# EAGLE design 2 (EAGLE 6.5.0)
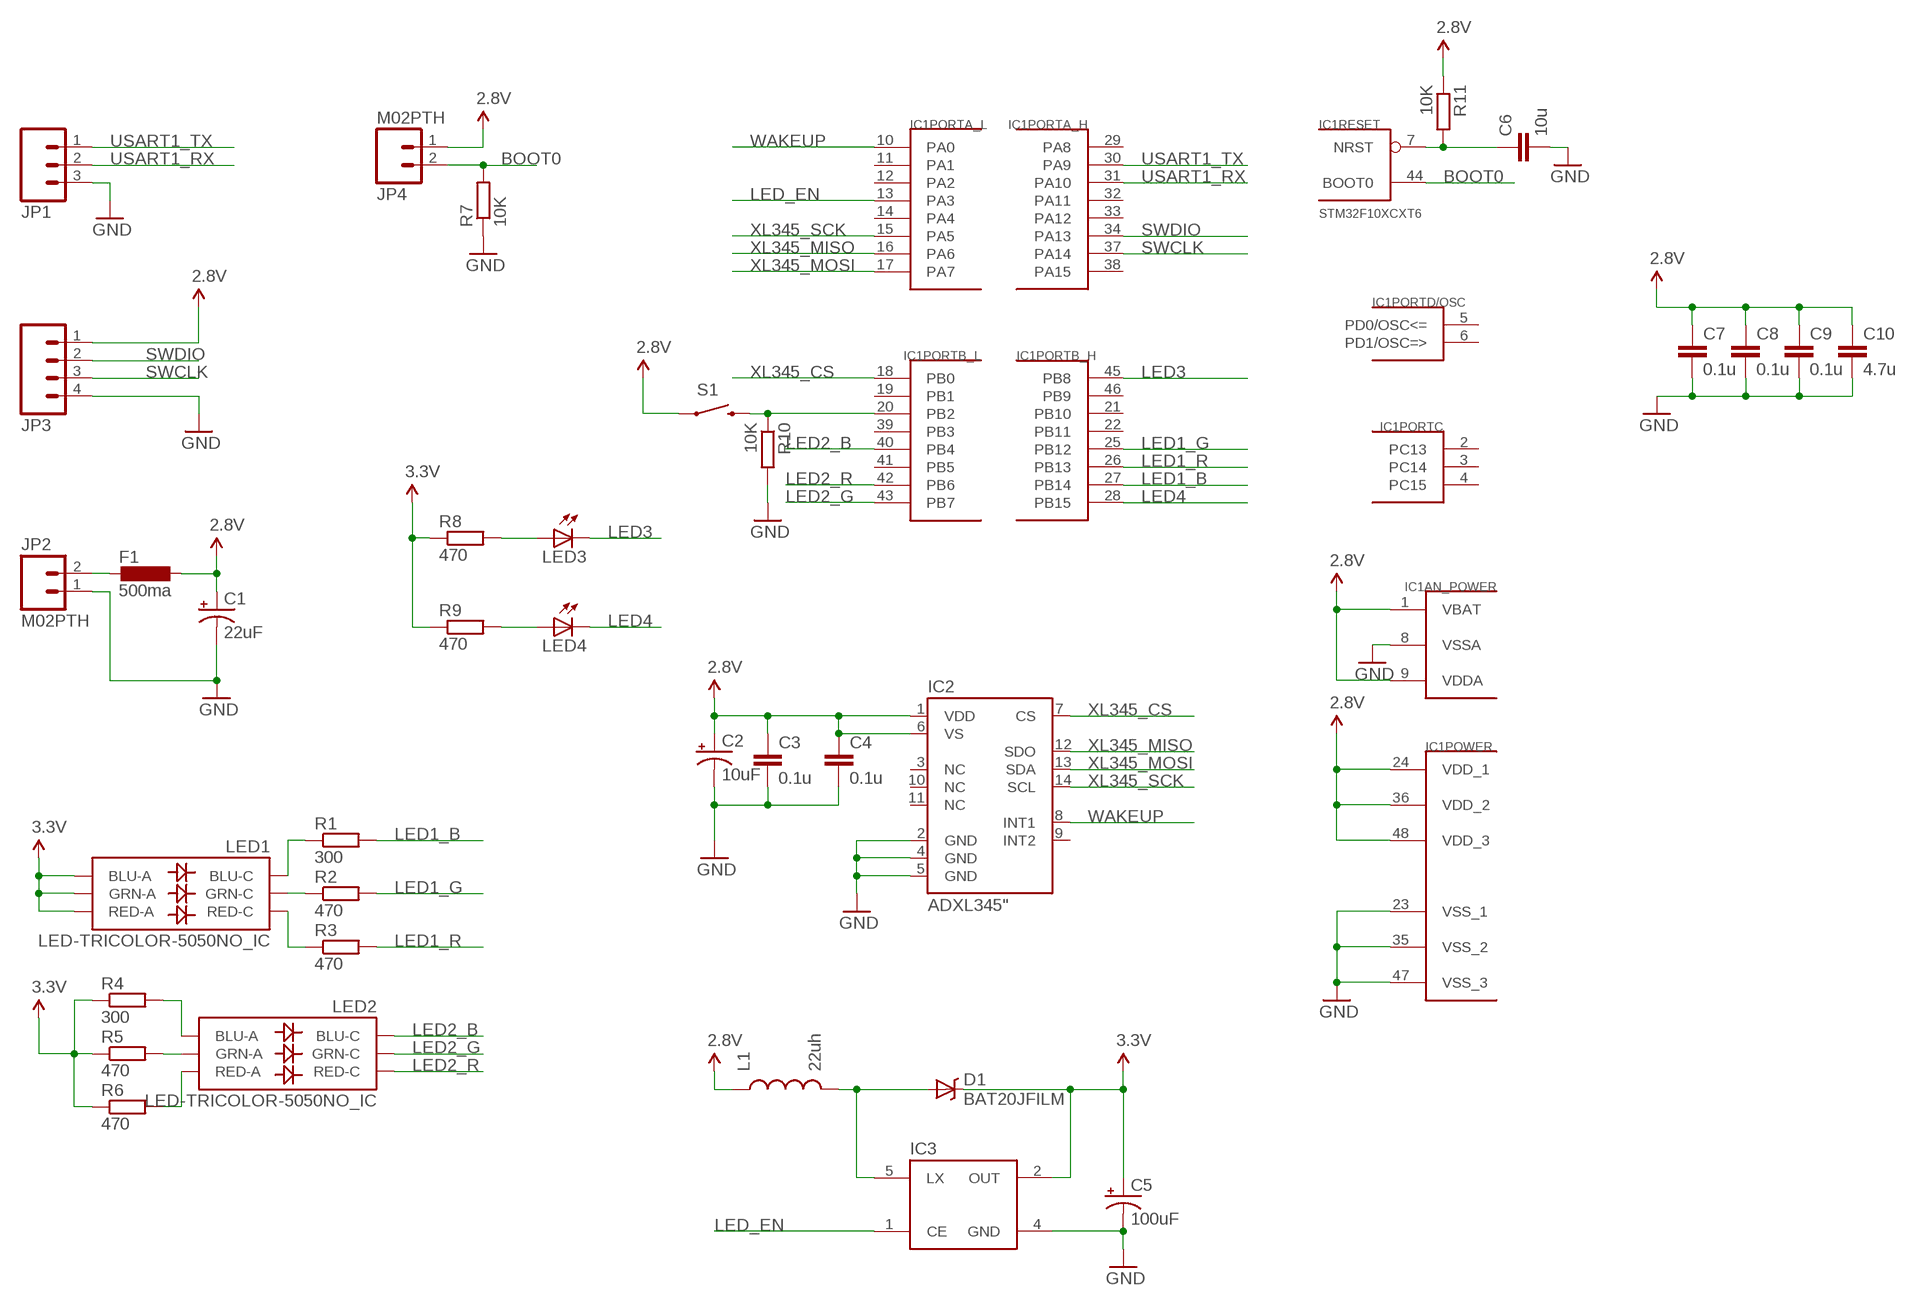
[diagram p0: schematic, sheet 1]

## Parts
C1  22uF  10UF-16V-10%(TANT)  [EIA3216]
C2  10uF  10UF-16V-10%(TANT)  [EIA3216]
C3  0.1u  C-EUC0603K  [C0603K]
C4  0.1u  C-EUC0603K  [C0603K]
C5  100uF  47UF-TANT  [EIA3528]
C6  10u  C-EUC0603K  [C0603K]
C7  0.1u  C-EUC0603K  [C0603K]
C8  0.1u  C-EUC0603K  [C0603K]
C9  0.1u  C-EUC0603K  [C0603K]
C10  4.7u  C-EUC0603K  [C0603K]
D1  BAT20JFILM  [SOD-323]
F1  500ma  L-EUL2012C  [L2012C]
IC1  STM32F10XCXT6  [TQFP48]
IC2  ADXL345"  [ADXL3451:1]
IC3  BL8530-XX2_RN  [SOT23-5]
JP1  M03PTH  [1X03]
JP2  M02PTH  [1X02]
JP3  M04PTH  [1X04]
JP4  M02PTH  [1X02]
L1  22uh  INDUCTORVLF4012A  [VLF4012A]
LED1  LED-TRICOLOR-5050NO_IC  [LED-TRICOLOR-5050]
LED2  LED-TRICOLOR-5050NO_IC  [LED-TRICOLOR-5050]
LED3  LED1206  [LED-1206]
LED4  LED1206  [LED-1206]
R1  300  R-EU_R0603  [R0603]
R2  470  R-EU_R0603  [R0603]
R3  470  R-EU_R0603  [R0603]
R4  300  R-EU_R0603  [R0603]
R5  470  R-EU_R0603  [R0603]
R6  470  R-EU_R0603  [R0603]
R7  10K  R-EU_R0603  [R0603]
R8  470  R-EU_R0603  [R0603]
R9  470  R-EU_R0603  [R0603]
R10  10K  R-EU_R0603  [R0603]
R11  10K  R-EU_R0603  [R0603]
S1  SWITCH-MOMENTARY-2-SMD-1101NE  [TACTILE-SWITCH-1101NE]

## Nets
2.8V: C1.A(+) C2.A(+) C3.1 C4.1 C7.1 C8.1 C9.1 C10.1 F1.1 IC1.1(AN_POWER:VBAT) IC1.9(AN_POWER:VDDA) IC1.24(POWER:VDD_1) IC1.36(POWER:VDD_2) IC1.48(POWER:VDD_3) IC2.1(VDD) IC2.6(VS) JP3.1 JP4.1 L1.P$1 R11.1 S1.P$1
3.3V: C5.A(+) D1.1(C) IC3.2(OUT) LED1.1(GRN-A) LED1.2(RED-A) LED1.3(BLU-A) R4.1 R5.1 R6.1 R8.1 R9.1
BOOT0: IC1.44(RESET:BOOT0) JP4.2 R7.2
GND: C1.C(-) C2.C(-) C3.2 C4.2 C5.C(-) C6.2 C7.2 C8.2 C9.2 C10.2 IC1.8(AN_POWER:VSSA) IC1.23(POWER:VSS_1) IC1.35(POWER:VSS_2) IC1.47(POWER:VSS_3) IC2.2(GND) IC2.4(GND) IC2.5(GND) IC3.4(GND) JP1.3 JP2.1 JP3.4 R7.1 R10.2
LED1_B: IC1.27(PORTB_H:PB14) R1.2
LED1_G: IC1.25(PORTB_H:PB12) R2.2
LED1_R: IC1.26(PORTB_H:PB13) R3.2
LED2_B: IC1.40(PORTB_L:PB4) LED2.4(BLU-C)
LED2_G: IC1.43(PORTB_L:PB7) LED2.6(GRN-C)
LED2_R: IC1.42(PORTB_L:PB6) LED2.5(RED-C)
LED3: IC1.45(PORTB_H:PB8) LED3.C
LED4: IC1.28(PORTB_H:PB15) LED4.C
LED_EN: IC1.13(PORTA_L:PA3) IC3.1(CE)
N$1: F1.2 JP2.2
N$2: IC1.20(PORTB_L:PB2) R10.1 S1.P$2
N$3: LED4.A R9.2
N$4: LED3.A R8.2
N$6: LED2.3(BLU-A) R4.2
N$7: LED1.6(GRN-C) R2.1
N$8: LED2.2(RED-A) R6.2
N$9: LED1.4(BLU-C) R1.1
N$10: LED2.1(GRN-A) R5.2
N$11: LED1.5(RED-C) R3.1
N$12: D1.2(A) IC3.5(LX) L1.P$2
RESET: C6.1 IC1.7(RESET:NRST) R11.2
SWCLK: IC1.37(PORTA_H:PA14) JP3.3
SWDIO: IC1.34(PORTA_H:PA13) JP3.2
USART1_RX: IC1.31(PORTA_H:PA10) JP1.2
USART1_TX: IC1.30(PORTA_H:PA9) JP1.1
WAKEUP: IC1.10(PORTA_L:PA0) IC2.8(INT1)
XL345_CS: IC1.18(PORTB_L:PB0) IC2.7(CS)
XL345_MISO: IC1.16(PORTA_L:PA6) IC2.12(SDO)
XL345_MOSI: IC1.17(PORTA_L:PA7) IC2.13(SDA)
XL345_SCK: IC1.15(PORTA_L:PA5) IC2.14(SCL)
Unconnected: IC1.2(PORTC:PC13) IC1.3(PORTC:PC14) IC1.4(PORTC:PC15) IC1.5(PORTD/OSC:PD0/OSC<=) IC1.6(PORTD/OSC:PD1/OSC=>) IC1.11(PORTA_L:PA1) IC1.12(PORTA_L:PA2) IC1.14(PORTA_L:PA4) IC1.19(PORTB_L:PB1) IC1.21(PORTB_H:PB10) IC1.22(PORTB_H:PB11) IC1.29(PORTA_H:PA8) IC1.32(PORTA_H:PA11) IC1.33(PORTA_H:PA12) IC1.38(PORTA_H:PA15) IC1.39(PORTB_L:PB3) IC1.41(PORTB_L:PB5) IC1.46(PORTB_H:PB9) IC2.3(NC) IC2.9(INT2) IC2.10(NC) IC2.11(NC)

## Library data of the parts
C1 = SparkFun-Capacitors:10UF-16V-10%(TANT): CAP-00811 1206/EIA-3216 Tantalum capacitor; PROD_ID: CAP-00811; VALUE: 10uF
C2 = SparkFun-Capacitors:10UF-16V-10%(TANT): CAP-00811 1206/EIA-3216 Tantalum capacitor; PROD_ID: CAP-00811
C3 C4 C6-C10 = rcl:C-EU: CAPACITOR, European symbol
C5 = SparkFun-Capacitors:47UF-TANT: 47uF Tantalum SMT CAP-08310- 10V 10% (EIA-3528); PROD_ID: CAP-08310; VALUE: 47uF
D1 = SparkFun-DiscreteSemi:BAT20JFILM: 23V, 1A Schottky diode, SOD-323 package; PROD_ID: DIO-11623
F1 = rcl:L-EU: INDUCTOR, European symbol
IC1 = stm32:STM32F10XCXT6: ST STM32F101/103 48pin LQFP
IC2 = SparkFun-Sensors:ADXL345: 3-axis SPI/I2C 2/4/8/16g accelerometer
IC3 = digital-toy:BL8530-XX2_RN: PFC step-up DC boost for BL8530, rn and some other 5 pin boost. by lishen, 2014.3.19
JP1 = SparkFun-Connectors:M03: Header 3 Standard 3-pin 0.1" header. Use with straight break away headers (SKU : PRT-00116), right angle break away headers (PRT-00553), swiss pins (PRT-00743), machine pins (PRT-00117), and female headers (PRT-00115). Molex polarized connector foot print use with SKU : PRT-08232 with associated crimp pins and housings.
JP2 JP4 = SparkFun-Connectors:M02: Standard 2-pin 0.1" header. Use with - straight break away headers ( PRT-00116) - right angle break away headers (PRT-00553) - swiss pins (PRT-00743) - machine pins (PRT-00117) - female headers (PRT-00115) Molex polarized connector foot print use with: PRT-08233 with associated crimp pins and housings. 2.54_SCREWTERM for use with PRT-10571. 3.5mm Screw Terminal footprints for PRT-08084 5mm Screw Terminal footprints for use with PRT-08433
JP3 = SparkFun-Connectors:M04: Header 4 Standard 4-pin 0.1" header. Use with straight break away headers (SKU : PRT-00116), right angle break away headers (PRT-00553), swiss pins (PRT-00743), machine pins (PRT-00117), and female headers (PRT-00115). Molex polarized connector foot print use with SKU : PRT-08231 with associated crimp pins and housings. 1MM SMD Version SKU: PRT-10208
L1 = SparkFun-Passives:INDUCTOR: Inductors Basic Inductor/Choke - 0603 and 1206. Footprints are not proven and vary greatly between part numbers. SRN6045- 33uH, 20% 1.4A SDR0403-560KL - 56uH, 10%, 500mA RMS/740mA peak
LED1 LED2 = SparkFun-LED:LED-TRICOLOR-5050
LED3 LED4 = SparkFun-LED:LED: LEDs Standard schematic elements and footprints for 5mm, 3mm, 1206, and 0603 sized LEDs. 5mm - Spark Fun Electronics SKU : COM-00529 (and others)
R1-R11 = rcl:R-EU_: RESISTOR, European symbol
S1 = SparkFun-Electromechanical:SWITCH-MOMENTARY-2: Various NO switches- pushbuttons, reed, etc

## Board
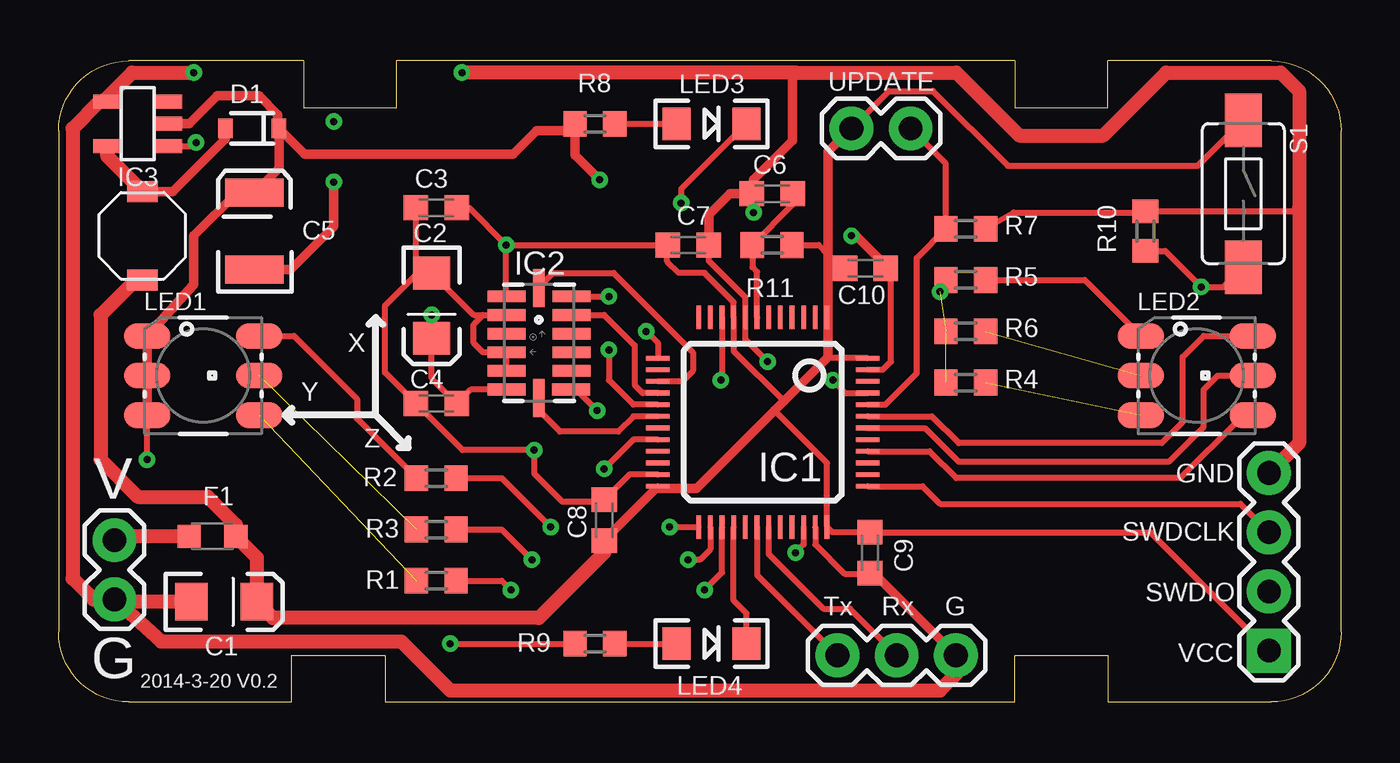
[diagram p1: board, top side]
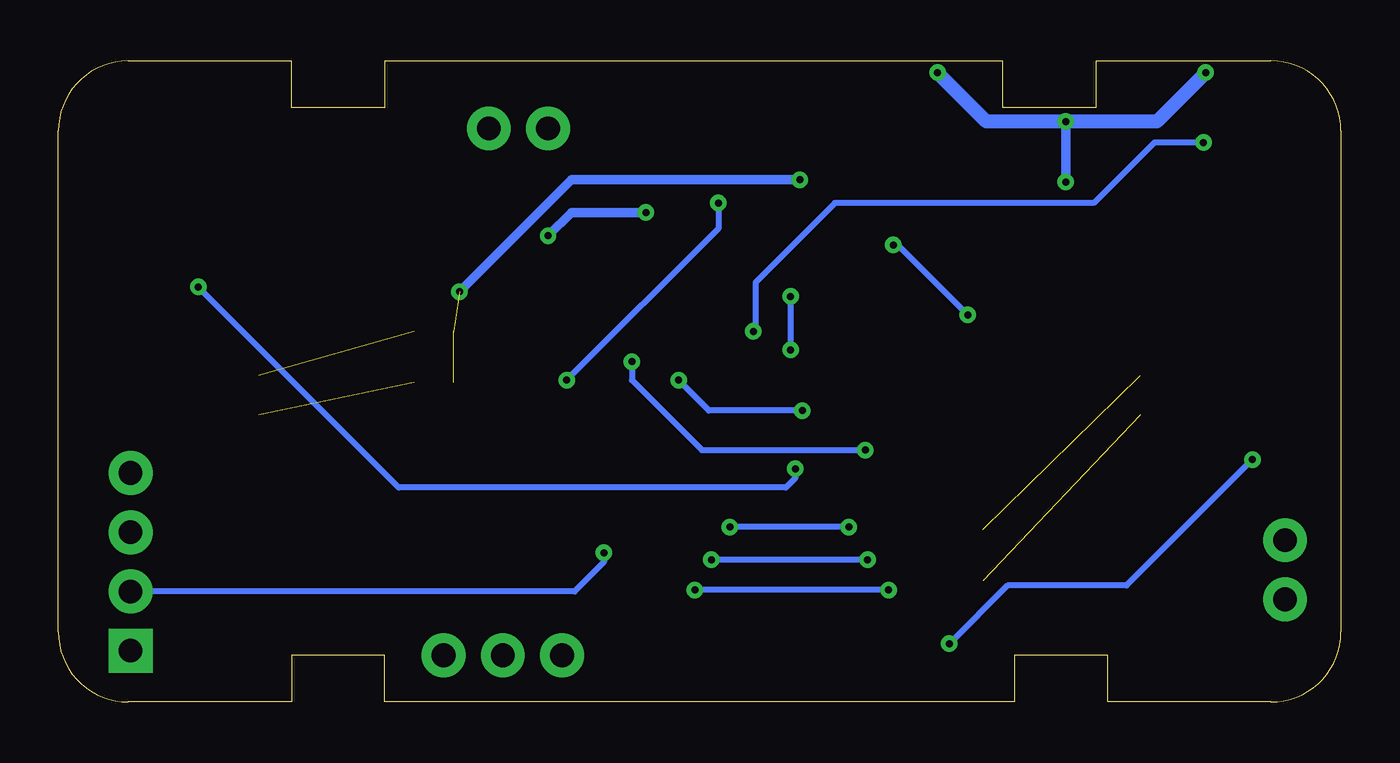
[diagram p2: board, bottom side, seen from below]

Size 55 x 27.5 mm. Coordinates in mm from the lower left corner, seen from the top.
Outline: 3,0 10,0 10,2 14,2 14,0 41,0 41,2 45,2 45,0 52,0 arc90 55,3 55,24.5 arc90 52,27.5 45,27.5 45,25.5 41,25.5 41,27.5 14.5,27.5 14.5,25.5 10.5,25.5 10.5,27.5 3,27.5 arc90 0,24.5 0,3 arc90 3,0
Copper layers (1*16): Top 0.035mm / dielectric 1.5mm / Bottom 0.035mm
Design rules "default *": minimum track width 10mil, minimum drill 24mil, track to track 8mil, track to pad 8mil, pad to pad 8mil, via to via 8mil, smd to smd 8mil, copper to edge 0.1mm, drill to drill 8mil, minimum pad ring 10mil, minimum via ring 8mil, stop-mask expansion 4mil, vias tented up to drill 0mil, thermal gap 10mil

### Footprints (pad centres in the part's own frame; a part is rotated, then mirrored left to right if it is on the bottom)
EIA3216 = smd 1.4 x 1.6: A 1.4,0; C -1.4,0
C0603K = smd 1.05 x 1.08: 1 -0.875,0; 2 0.875,0
EIA3528 = smd 1.2 x 2.5: A 1.65,0; C -1.65,0
SOD-323 = smd 0.63 x 0.83: 1 -1.15,0; 2 1.15,0
L2012C = smd 1 x 1: 1 -1,0; 2 1,0
TQFP48 = smd 0.2 x 1: 1 -2.75,-4.5; 2 -2.25,-4.5; 3 -1.75,-4.5; 4 -1.25,-4.5; 5 -0.75,-4.5; 6 -0.25,-4.5; 7 0.25,-4.5; 8 0.75,-4.5; 9 1.25,-4.5; 10 1.75,-4.5; 11 2.25,-4.5; 12 2.75,-4.5; 25 2.75,4.5; 26 2.25,4.5; 27 1.75,4.5; 28 1.25,4.5; 29 0.75,4.5; 30 0.25,4.5; 31 -0.25,4.5; 32 -0.75,4.5; 33 -1.25,4.5; 34 -1.75,4.5; 35 -2.25,4.5; 36 -2.75,4.5 | smd 1 x 0.2: 13 4.5,-2.75; 14 4.5,-2.25; 15 4.5,-1.75; 16 4.5,-1.25; 17 4.5,-0.75; 18 4.5,-0.25; 19 4.5,0.25; 20 4.5,0.75; 21 4.5,1.25; 22 4.5,1.75; 23 4.5,2.25; 24 4.5,2.75; 37 -4.5,2.75; 38 -4.5,2.25; 39 -4.5,1.75; 40 -4.5,1.25; 41 -4.5,0.75; 42 -4.5,0.25; 43 -4.5,-0.25; 44 -4.5,-0.75; 45 -4.5,-1.25; 46 -4.5,-1.75; 47 -4.5,-2.25; 48 -4.5,-2.75
ADXL3451:1 = smd 0.5 x 1.632: 1 2,1.392; 2 1.2,1.392; 3 0.4,1.392; 4 -0.4,1.392; 5 -1.2,1.392; 6 -2,1.392; 8 -2,-1.384; 9 -1.2,-1.392; 10 -0.4,-1.392; 11 0.4,-1.392; 12 1.2,-1.392; 13 2,-1.392 | smd 1.632 x 0.5: 7 -2.354,0; 14 2.354,0
SOT23-5 = smd 0.6 x 1.2: 1 -0.95,-1.306; 2 0,-1.306; 3 0.95,-1.306; 4 0.95,1.306; 5 -0.95,1.306
1X03 = drill 1.016 pad 1.88: 1 0,0; 2 2.54,0; 3 5.08,0
1X02 = drill 1.016 pad 1.88: 1 0,0; 2 2.54,0
1X04 = drill 1.016 pad 1.88 square: 1 0,0 | drill 1.016 pad 1.88: 2 2.54,0; 3 5.08,0; 4 7.62,0
VLF4012A = smd 0.9 x 1.3: P$1 -1.9,0; P$2 1.9,0
LED-TRICOLOR-5050 = smd 2 x 1.1: 1 -2.4,1.7; 2 -2.4,0; 3 -2.4,-1.7; 4 2.4,-1.7; 5 2.4,0; 6 2.4,1.7
LED-1206 = smd 1.2 x 1.4: A -1.5,0; C 1.5,0
R0603 = smd 1 x 1.1: 1 -0.85,0; 2 0.85,0
TACTILE-SWITCH-1101NE = smd 2.3 x 1.6: P$1 -3.15,0; P$2 3.15,0

### Placement (x,y rotation side)
C1  7.1,4.3 0 top
C2  16,17 270 top
C3  16.2,21.2 180 top
C4  16.2,12.8 180 top
C5  8.4,20.2 90 top
C6  30.6,21.8 180 top
C7  27,19.6 0 top
C8  23.4,7.8 90 top
C9  34.79,6.4 270 top
C10  34.6,18.6 0 top
D1  8.3,24.6 180 top
F1  6.6,7.1 180 top
IC1  30.2,12 180 top
IC2  20.6,15.4 90 top
IC3  3.4,24.8 90 top
JP1  33.4,2 0 top
JP2  2.4,4.4 90 top
JP3  51.9,2.2 90 top
JP4  34,24.6 0 top
L1  3.6,20 90 top
LED1  6.2,14 0 top
LED2  48.8,14 0 top
LED3  28,24.8 0 top
LED4  28,2.5 0 top
R1  16.2,5.2 0 top
R2  16.2,9.6 0 top
R3  16.2,7.4 0 top
R4  38.9,13.7 0 top
R5  38.9,18.1 0 top
R6  38.9,15.9 0 top
R7  38.9,20.3 180 top
R8  23,24.8 0 top
R9  23,2.5 0 top
R10  46.6,20.2 90 top
R11  30.6,19.6 180 top
S1  50.8,21.8 270 top

### Tracks (layer width: path | path; a pad name or v marks a point on that pad's centre or on a via)
2.8V  (via drill 0.3)
  Top 0.254: IC2.6 17.68,13.4 C4.1 16,13.88 C2.A v16,16.6 | IC1.48 33.05,14.75 33,14.8 33,16.45 IC1.1 | 31.1,12.9 28.95,15.05 IC1.9 28.95,17.15 27.7,18.4 26.6,18.4 26.1,18.9 26.1,19.57 C7.1 v19.2,19.6 | 30.7,12.5 32.95,10.25 IC1.36 33.17,7.28 C9.1 46.83,7.28 JP3.1 | JP4.1 35.6,26.2 37.5,26.2 40.7,23 48.85,23 S1.P$1 | R11.1 32.6,19.6 33,19.2 | v19.2,19.6 17.6,21.2 C3.1 | IC2.1 v19.2,19.6 | C10.1 33,18.6 | IC1.24 25.7,9.15
  Top 0.406: JP4.1 33,23.6 33,19.2 33,18.6 33,14.8 31.1,12.9 30.7,12.5 27.35,9.15 25.7,9.15 25.62,9.15 C8.1 23.4,6.4
  Top 0.61: L1.P$1 3.3,18.1 1.8,16.6 1.8,10.4 3.4,8.8 6.4,8.8 7.6,7.6 F1.1 8.5,6.2 C1.A 9.2,3.6 20.6,3.6 23.4,6.4
  Bottom 0.254: v16,16.6 19,19.6 v19.2,19.6
3.3V  (via drill 0.3)  (2 unrouted)
  Top 0.254: v3.8,10.4 LED1.3 | v37.8,17.6 38.3,18.1 R5.1 | v16.8,2.5 R9.1
  Top 0.406: LED1.3 LED1.2 LED1.1 5.8,17.9 5.8,20 7.65,21.85 C5.A 9.45,22.9 D1.1 | IC3.2 5.6,24.8 6.8,26 8.6,26 9.4,25.2 9.4,24.65 D1.1 | 21.95,24.6 R8.1 | R8.1 22.15,23.45 v23.2,22.4 | R8.1 21.85,24.5 20.5,24.5 19.5,23.5 10.55,23.5 D1.1
  Bottom 0.254: v3.8,10.4 9.2,5 14.3,5 v16.8,2.5
  Bottom 0.406: v23.2,22.4 33,22.4 v37.8,17.6
BOOT0
  Top 0.254: IC1.44 35.45,12.75 36.8,14.1 36.8,19.05 R7.2 38.05,23.09 JP4.2
GND  (via drill 0.3)
  Top 0.254: IC2.5 IC2.4 18.2,15 17.8,15.4 17.8,16.2 18.2,16.6 | 18.2,16.6 IC2.2 | C2.C 15.32,19.07 C3.2 | C2.C 17.8,16.6 18.2,16.6 | C2.C 15.4,18.4 14,17 14,14.12 C4.2 17.32,10.8 v20.4,10.8 20.4,9.8 21.6,8.6 23.32,8.6 C8.2 24.48,9.75 IC1.23 | C7.2 27.88,18.93 29.45,17.35 IC1.8 29.45,15.55 v30.4,14.6 | 53.2,21.2 53.05,21.05 R10.2 46.55,21 40.95,21 R7.1 | 35.7,18.38 35.7,14.6 35.35,14.25 IC1.47 | 35.7,18.38 C10.2 | IC1.35 32.45,6.75 33.7,5.5 34.77,5.5 C9.2 | 35.7,18.38 35.7,18.5 35.5,18.7
  Top 0.406: JP1.3 34.95,5.53 C9.2 | 2,25.84 IC3.4 | C6.2 29.8,21.88 29.8,22.4 31.48,24.07 31.48,26.88 31.6,27 | C6.2 28.8,21.8 27.9,20.9 27.9,19.62 C7.2 | 35.5,18.7 34.2,20 v34,20 | v29.8,21 29.73,21.07 C6.2 | C5.C 9.95,18.55 11.8,20.4 v11.8,22.3
  Top 0.61: IC3.4 1.75,25.75 0.6,24.6 0.6,5.3 1.5,4.4 JP2.1 | 2,25.84 3.16,27 v5.8,27 | JP3.4 53.2,11.12 53.2,21.2 53.2,26.2 52.4,27 47.5,27 44.8,24.3 41.2,24.3 38.5,27 31.6,27 v17.3,27 | C1.C 2.5,4.3 JP2.1 | JP2.1 4.4,2.6 14.7,2.6 16.8,0.5 37.8,0.5 38.5,1.2 38.5,1.98 JP1.3
  Bottom 0.254: v30.4,14.6 30.4,13.8 27.4,10.8 v20.4,10.8
  Bottom 0.406: v34,20 33,21 v29.8,21 | v11.8,22.3 v11.8,24.9
  Bottom 0.61: v5.8,27 7.9,24.9 v11.8,24.9 15.2,24.9 v17.3,27
LED1_B  (via drill 0.3)
  Top 0.254: R1.2 19,5.2 v19.4,4.8 | v27.7,4.8 28.45,5.55 IC1.27
  Bottom 0.254: v19.4,4.8 v27.7,4.8
LED1_G  (via drill 0.3)
  Top 0.254: R2.2 19,9.6 v21.1,7.5 | v26.2,7.5 IC1.25
  Bottom 0.254: v21.1,7.5 v26.2,7.5
LED1_R  (via drill 0.3)
  Top 0.254: R3.2 19,7.4 v20.3,6.1 | 27.2,6.1 v27,6.1 27.5,6.1 27.95,6.55 IC1.26
  Bottom 0.254: v20.3,6.1 v27,6.1
LED2_B
  Top 0.254: LED2.4 50.6,12.3 50.6,12.1 48.1,9.6 38.5,9.6 37.35,10.75 IC1.40
LED2_G
  Top 0.254: IC1.43 37.45,12.25 38.6,11.1 47.3,11.1 48.2,12 48.2,14.8 49.1,15.7 LED2.6
LED2_R
  Top 0.254: IC1.42 37.15,11.75 38.6,10.3 47.6,10.3 49.1,11.8 49.1,13.4 49.7,14 LED2.5
LED3  (via drill 0.3)
  Top 0.254: LED3.C 26.7,22 v26.7,21.4 | v33.2,13.8 33.75,13.25 IC1.45
  Bottom 0.254: v26.7,21.4 26.7,20.3 v33.2,13.8
LED4
  Top 0.254: LED4.C 29.5,3.8 28.95,4.35 IC1.28
LED_EN  (via drill 0.3)
  Top 0.254: IC3.1 5.75,23.85 v5.9,24 | v25.2,15.9 25.7,15.4 IC1.13
  Bottom 0.254: v5.9,24 8,24 10.6,21.4 21.7,21.4 25.1,18 25.1,16 v25.2,15.9
N$1
  Top 0.61: F1.2 2.56,7.1 JP2.2
N$2  (via drill 0.3)
  Top 0.254: IC1.20 24.65,11.25 v23.4,10 | S1.P$2 49.95,17.8 v49,17.8 47.45,19.35 R10.1
  Bottom 0.254: v23.4,10 23.4,9.6 23.8,9.2 40.4,9.2 v49,17.8
N$3
  Top 0.254: R9.2 LED4.A
N$4
  Top 0.254: R8.2 LED3.A
N$6  (1 unrouted)
N$7
  Top 0.254: LED1.6 10.1,15.7 12.8,13 12.8,12.15 R2.1
N$8  (1 unrouted)
N$9  (1 unrouted)
N$10
  Top 0.254: R5.2 44,18.1 LED2.1
N$11  (1 unrouted)
N$12
  Top 0.406: L1.P$2 4.9,21.9 7.15,24.15 D1.2
  Top 0.61: L1.P$2 2.09,23.41 IC3.5
RESET
  Top 0.254: C6.1 31.48,21.32 R11.2 29.75,18.65 29.95,18.45 IC1.7
SWCLK
  Top 0.254: IC1.37 37.05,9.25 37.8,8.5 50.68,8.5 JP3.3
SWDIO  (via drill 0.3)
  Top 0.254: IC1.34 31.95,6.75 v31.6,6.4
  Bottom 0.254: v31.6,6.4 31.6,6 32.86,4.74 JP3.2
USART1_RX
  Top 0.254: IC1.31 30.45,6.35 32.8,4 33.94,4 JP1.2
USART1_TX
  Top 0.254: IC1.30 29.95,5.45 JP1.1
WAKEUP  (via drill 0.3)
  Top 0.254: IC2.8 22.2,13.4 v23.1,12.5 | IC1.10 28.45,13.85 v28.4,13.8
  Bottom 0.254: v23.1,12.5 27.1,12.5 v28.4,13.8
XL345_CS
  Top 0.254: IC2.7 20.6,12.5 21.5,11.6 24,11.6 24.65,12.25 IC1.18
XL345_MISO
  Top 0.254: IC2.12 23.4,16.6 24.7,15.3 24.7,13.6 25.05,13.25 IC1.16
XL345_MOSI  (via drill 0.3)
  Top 0.254: IC2.13 v23.6,17.4 | v23.6,15.1 23.6,13.8 24.65,12.75 IC1.17
  Bottom 0.254: v23.6,17.4 v23.6,15.1
XL345_SCK
  Top 0.254: IC2.14 20.6,17.8 21.2,18.4 23.8,18.4 27.2,15 27.2,14.2 26.75,13.75 IC1.15

### Text on the board
tPlace: UPDATE | X | Y | Z | V | GND | SWDCLK | Tx | Rx | G | SWDIO | VCC | G
tNames: 2014-3-20 V0.2